# EAGLE design 315MHz Antenna BRD (EAGLE 7.7.0)
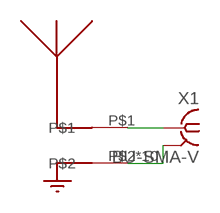
[diagram p0: schematic, sheet 1]

## Parts
U$1  ANT-315-SP  [ANT-315-SP]
X1  BU-SMA-V  [BU-SMA-V]

## Nets
GND: U$1.P$2 U$1.P$3 U$1.P$4 U$1.P$5 U$1.P$6 U$1.P$7 U$1.P$8 U$1.P$9 U$1.P$10 U$1.P$11 X1.2 X1.3 X1.4 X1.5
N$2: U$1.P$1 X1.1

## Library data of the parts
U$1 = linx:ANT-315-SP
X1 = con-coax:BU-SMA-V: FEMALE SMA CONNECTOR Radiall distributor RS 112-3794; OC_FARNELL: unknown; OC_NEWARK: unknown

## Board
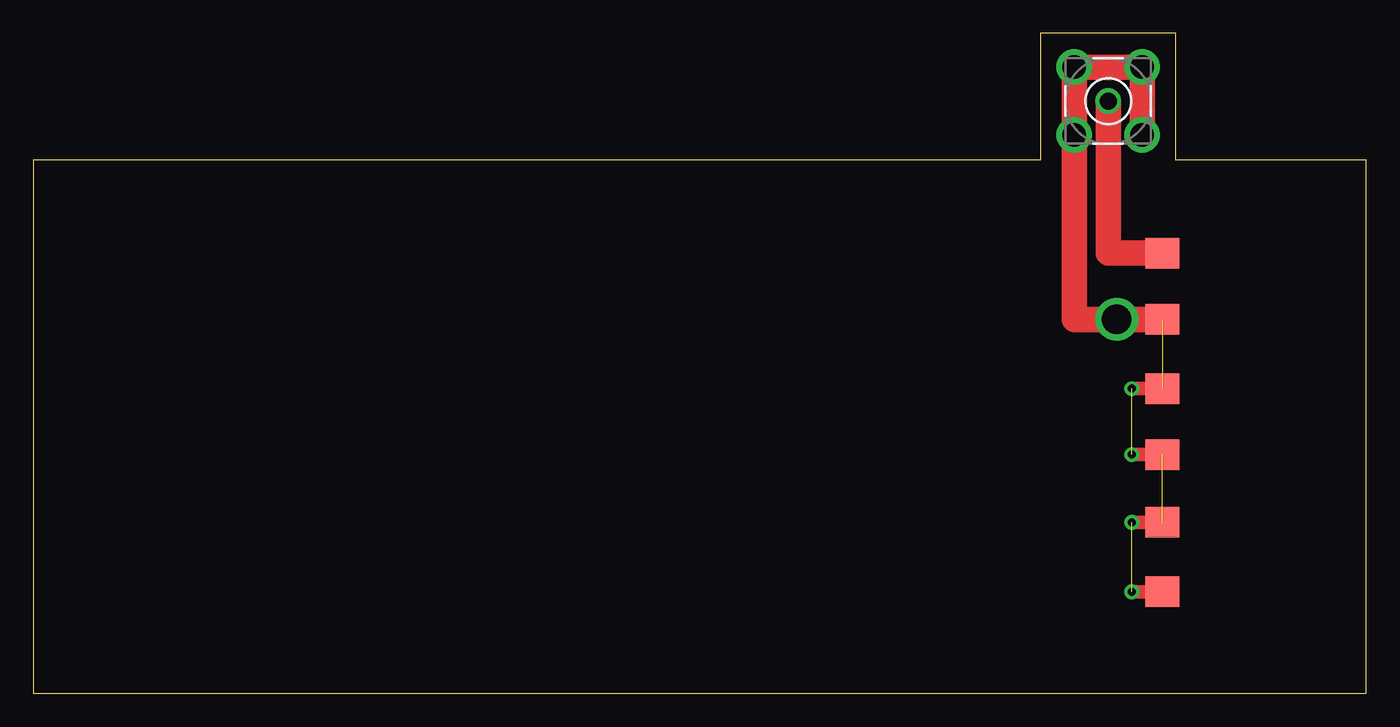
[diagram p1: board, top side]
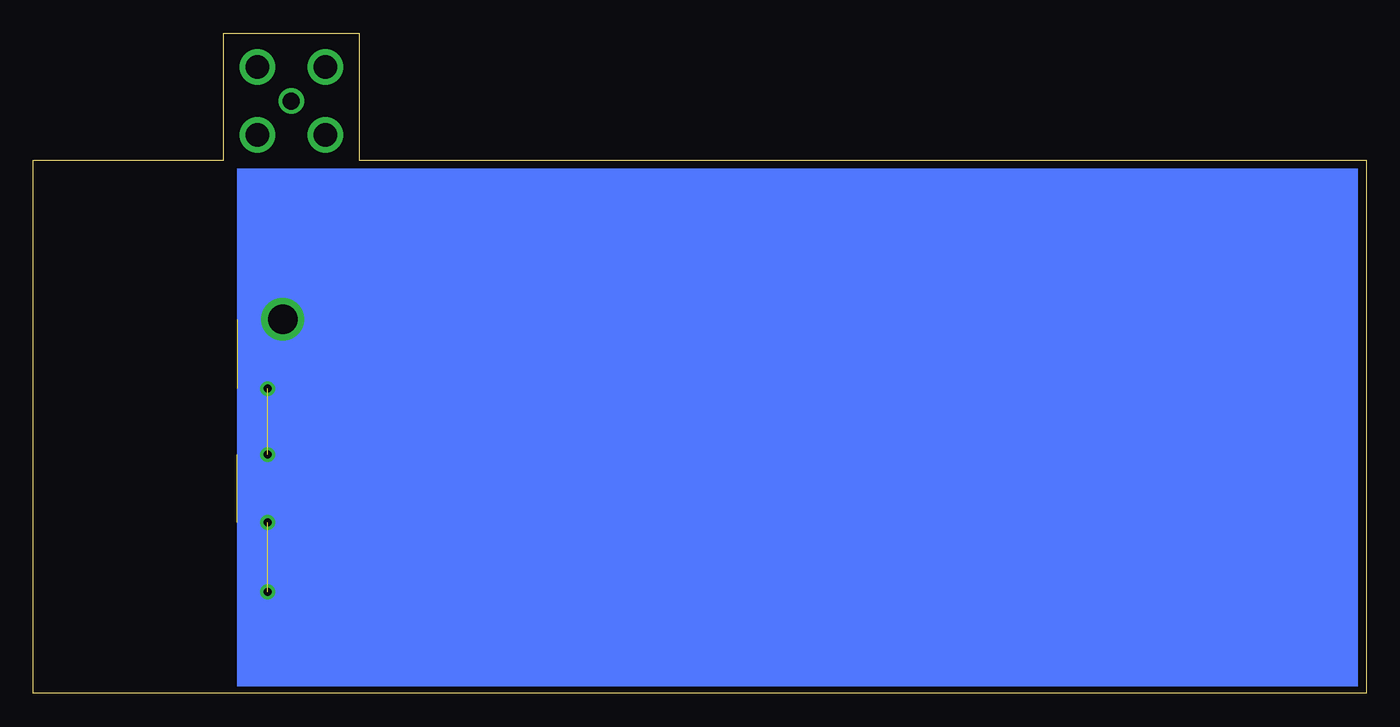
[diagram p2: board, bottom side, seen from below]

Size 100 x 49.53 mm. Coordinates in mm from the lower left corner, seen from the top.
Outline: 0,0 100,0 100,40.01 85.72,40.01 85.72,49.53 75.56,49.53 75.56,40.01 0,39.99 0,0
Copper layers (1*16): Top 0.035mm / dielectric 1.5mm / Bottom 0.035mm
Design rules "default": minimum track width 10mil, minimum drill 24mil, track to track 8mil, track to pad 8mil, pad to pad 8mil, via to via 8mil, smd to smd 8mil, copper to edge 40mil, drill to drill 8mil, minimum pad ring 10mil, minimum via ring 8mil, stop-mask expansion 4mil, vias tented up to drill 0mil, thermal gap 10mil

### Footprints (pad centres in the part's own frame; a part is rotated, then mirrored left to right if it is on the bottom)
ANT-315-SP = smd 2.286 x 2.54: P$1 6.35,84.074; P$2 11.303,84.074; P$3 16.51,84.074; P$4 21.463,84.074; P$5 26.543,84.074; P$6 31.75,84.074 | drill 0.6: P$7 31.75,81.788; P$8 26.543,81.788; P$9 21.463,81.788; P$10 16.51,81.788 | drill 2.2: P$11 11.303,80.645
BU-SMA-V = drill 1.27: 1 0,0 | drill 1.778: 2 -2.55,2.55; 3 2.55,2.55; 4 2.55,-2.55; 5 -2.55,-2.55

### Placement (x,y rotation side)
U$1  0.64,39.37 270 top
X1  80.64,44.45 180 top

### Tracks (layer width: path | path; a pad name or v marks a point on that pad's centre or on a via)
GND  (4 unrouted)
  Top 1.93: X1.2 X1.5 X1.4 X1.3 78.09,28.07 U$1.P$2
N$2
  Top 1.93: U$1.P$1 80.64,33.02 X1.1